# EAGLE design brama (EAGLE 6.3)
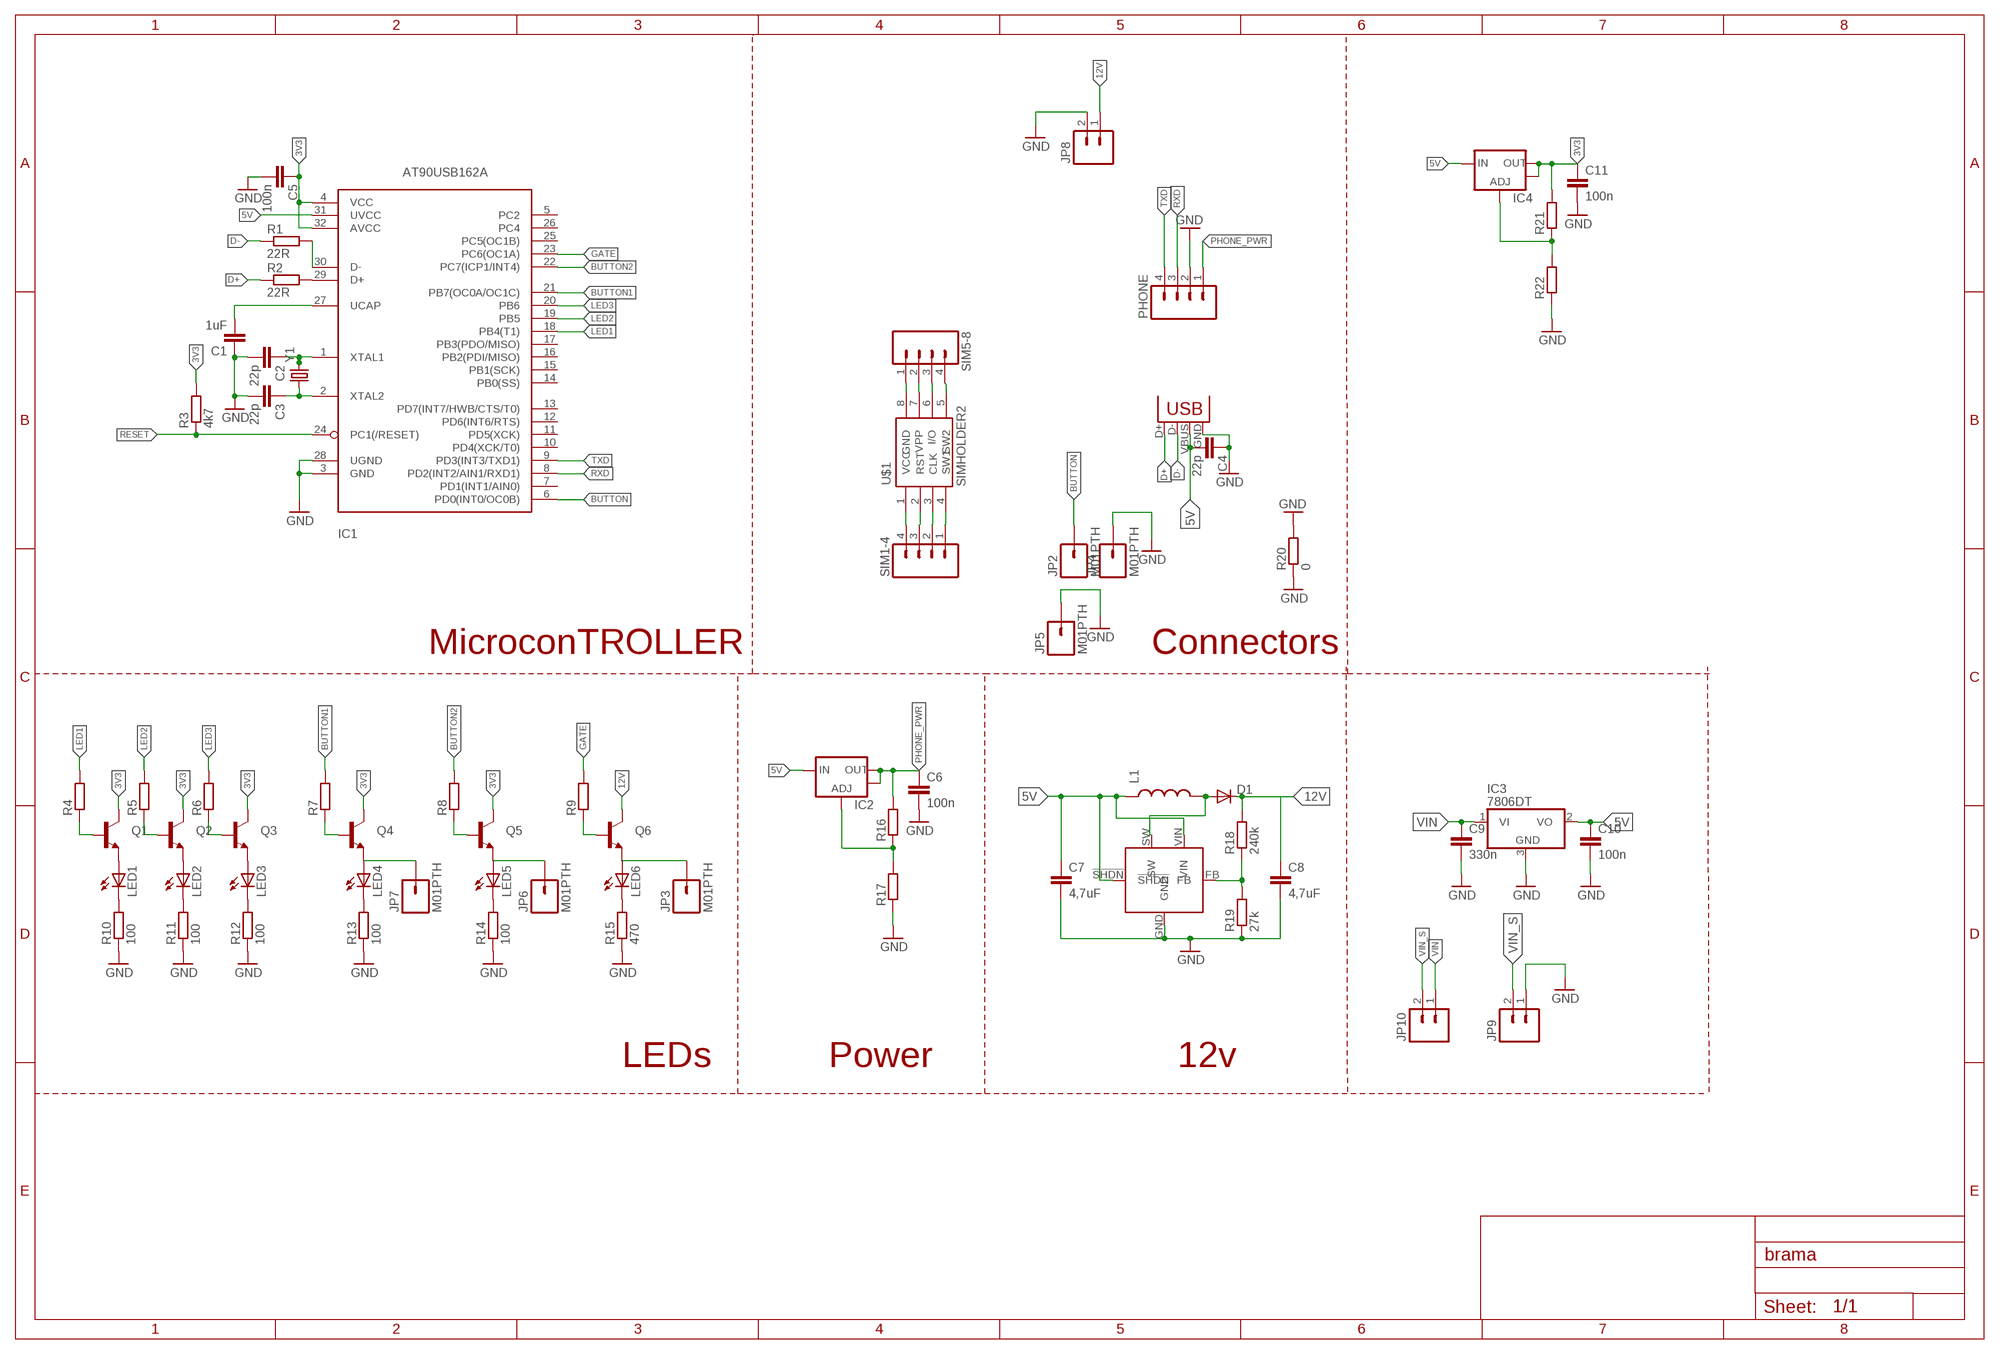
[diagram p0: schematic, sheet 1]

## Parts
C1  1uF  C-EUC0805  [C0805]
C2  22p  C-EUC0805  [C0805]
C3  22p  C-EUC0805  [C0805]
C4  22p  C-EUC0805  [C0805]
C5  100n  C-EUC0805  [C0805]
C6  100n  C-EUC0805  [C0805]
C7  4,7uF  C-EUC0805  [C0805]
C8  4,7uF  C-EUC0805  [C0805]
C9  330n  C-EUC0805  [C0805]
C10  100n  C-EUC0805  [C0805]
C11  100n  C-EUC0805  [C0805]
D1  DIODESMB  [SMB-DIODE]
IC1  AT90USB162A  [TQFP32-08]
IC2  V_REG_LM1117SOT223  [SOT223]
IC3  7806DT  [TO252]
IC4  V_REG_LM1117SOT223  [SOT223]
JP1  USBSMD  [USB-MINIB]
JP2  M01PTH  [1X01]
JP3  M01PTH  [1X01]
JP4  M01PTH  [1X01]
JP5  M01PTH  [1X01]
JP6  M01PTH  [1X01]
JP7  M01PTH  [1X01]
JP8  M02PTH3  [1X02_LONGPADS]
JP9  M02PTH3  [1X02_LONGPADS]
JP10  M02PTH3  [1X02_LONGPADS]
L1  INDUCTOR0805  [0805]
LED1  LEDCHIPLED_0805  [CHIPLED_0805]
LED2  LEDCHIPLED_0805  [CHIPLED_0805]
LED3  LEDCHIPLED_0805  [CHIPLED_0805]
LED4  LEDCHIPLED_0805  [CHIPLED_0805]
LED5  LEDCHIPLED_0805  [CHIPLED_0805]
LED6  LEDCHIPLED_0805  [CHIPLED_0805]
PHONE  M04LONGPADS  [1X04_LONGPADS]
Q1  TRANSISTOR_NPNSOT23  [SOT23]
Q2  TRANSISTOR_NPNSOT23  [SOT23]
Q3  TRANSISTOR_NPNSOT23  [SOT23]
Q4  TRANSISTOR_NPNSOT23  [SOT23]
Q5  TRANSISTOR_NPNSOT23  [SOT23]
Q6  TRANSISTOR_NPNSOT23  [SOT23]
R1  22R  R-EU_R0805  [R0805]
R2  22R  R-EU_R0805  [R0805]
R3  4k7  R-EU_R0805  [R0805]
R4  R-EU_R0805  [R0805]
R5  R-EU_R0805  [R0805]
R6  R-EU_R0805  [R0805]
R7  R-EU_R0805  [R0805]
R8  R-EU_R0805  [R0805]
R9  R-EU_R0805  [R0805]
R10  100  R-EU_R0805  [R0805]
R11  100  R-EU_R0805  [R0805]
R12  100  R-EU_R0805  [R0805]
R13  100  R-EU_R0805  [R0805]
R14  100  R-EU_R0805  [R0805]
R15  470  R-EU_R0805  [R0805]
R16  R-EU_R0805  [R0805]
R17  R-EU_R0805  [R0805]
R18  240k  R-EU_R0805  [R0805]
R19  27k  R-EU_R0805  [R0805]
R20  0  R-EU_R0805  [R0805]
R21  R-EU_R0805  [R0805]
R22  R-EU_R0805  [R0805]
SIM1-4  M04LONGPADS  [1X04_LONGPADS]
SIM5-8  M04LONGPADS  [1X04_LONGPADS]
U$1  SIMHOLDER2  [SIMHOLDER2]
U$6  LM2704MF-ADJ  [SOT23-5]
Y1  CRYSTALSMD  [HC49UP]

## Nets
3V3: C5.1 C11.1 IC1.4(VCC) IC1.32(AVCC) IC4.2(OUT) IC4.4(OUT) Q1.3(C) Q2.3(C) Q3.3(C) Q4.3(C) Q5.3(C) R3.2 R21.2
5V: C4.2 C7.1 C10.1 IC1.31(UVCC) IC2.3(IN) IC3.2(VO) IC4.3(IN) JP1.VBUS L1.1 U$6.!SHDN U$6.VIN
12V: C8.1 D1.C JP8.1 Q6.3(C) R18.2
BUTTON: IC1.6(PD0(INT0/OC0B)) JP2.1
BUTTON1: IC1.21(PB7(OC0A/OC1C)) R7.2
BUTTON2: IC1.22(PC7(ICP1/INT4)) R8.2
D+: JP1.D+ R2.1
D-: JP1.D- R1.1
GATE: IC1.23(PC6(OC1A)) R9.2
GND: C1.1 C2.2 C3.2 C4.1 C5.2 C6.2 C7.2 C8.2 C9.2 C10.2 C11.2 IC1.3(GND) IC1.28(UGND) IC3.3(GND) JP1.GND JP4.1 JP5.1 JP8.2 JP9.1 PHONE.2 R10.1 R11.1 R12.1 R13.1 R14.1 R15.1 R17.1 R19.1 R20.1 R20.2 R22.1 U$6.GND
LED1: IC1.18(PB4(T1)) R4.2
LED2: IC1.19(PB5) R5.2
LED3: IC1.20(PB6) R6.2
N$1: IC1.30(D-) R1.2
N$2: IC1.29(D+) R2.2
N$3: C2.1 IC1.1(XTAL1) Y1.2
N$4: C3.1 IC1.2(XTAL2) Y1.1
N$5: SIM1-4.4 U$1.1(VCC)
N$6: LED1.A Q1.2(E)
N$7: LED2.A Q2.2(E)
N$8: LED3.A Q3.2(E)
N$9: JP7.1 LED4.A Q4.2(E)
N$10: JP6.1 LED5.A Q5.2(E)
N$11: JP3.1 LED6.A Q6.2(E)
N$12: Q1.1(B) R4.1
N$13: Q2.1(B) R5.1
N$14: Q3.1(B) R6.1
N$15: Q4.1(B) R7.1
N$16: Q5.1(B) R8.1
N$17: Q6.1(B) R9.1
N$18: LED1.C R10.2
N$19: LED2.C R11.2
N$20: LED3.C R12.2
N$21: LED4.C R13.2
N$22: LED5.C R14.2
N$23: LED6.C R15.2
N$24: SIM5-8.1 U$1.8(GND)
N$25: SIM5-8.2 U$1.7(VPP)
N$26: SIM5-8.3 U$1.6(I/O)
N$27: SIM5-8.4 U$1.5(SW2)
N$28: SIM1-4.1 U$1.4(SW1)
N$29: SIM1-4.2 U$1.3(CLK)
N$30: SIM1-4.3 U$1.2(RST)
N$31: D1.A L1.2 U$6.SW
N$32: IC2.1(ADJ) R16.1 R17.2
N$33: IC4.1(ADJ) R21.1 R22.2
N$34: R18.1 R19.2 U$6.FB
PHONE_PWR: C6.1 IC2.2(OUT) IC2.4(OUT) PHONE.1 R16.2
RESET: IC1.24(PC1(/RESET)) R3.1
RXD: IC1.8(PD2(INT2/AIN1/RXD1)) PHONE.3
TXD: IC1.9(PD3(INT3/TXD1)) PHONE.4
UCAP: C1.2 IC1.27(UCAP)
VIN: C9.1 IC3.1(VI) JP10.1
VIN_S: JP9.2 JP10.2
Unconnected: IC1.5(PC2) IC1.7(PD1(INT1/AIN0)) IC1.10(PD4(XCK/T0)) IC1.11(PD5(XCK)) IC1.12(PD6(INT6/RTS)) IC1.13(PD7(INT7/HWB/CTS/T0)) IC1.14(PB0(SS)) IC1.15(PB1(SCK)) IC1.16(PB2(PDI/MISO)) IC1.17(PB3(PDO/MISO)) IC1.25(PC5(OC1B)) IC1.26(PC4)

## Notes on the sheet
- MicroconTROLLER | Connectors
- LEDs | Power | 12v

## Library data of the parts
C1-C11 = rcl:C-EU: CAPACITOR, European symbol
D1 = SparkFun-DiscreteSemi:DIODE: Diode These are standard reverse protection diodes and small signal diodes. SMA package can handle up to about 1A. SOD-323 can handle about 200mA. What the SOD-323 package when ordering, there are some mfgs out there that are 5-pin packages.
IC1 = adafruit:AT90USB162: MICROCONTROLLER 8 Kbytes FLASH 1 kbytes SRAM 512 bytes EEPROM USART 6-channel 10 bit ADC 2-channel 8 bit ADC
IC2 IC4 = SparkFun-PowerIC:V_REG_LM1117: Voltage Regulator LM1117 Standard adjustable voltage regulator but in SMD form. Spark Fun Electronics SKU : COM-00595
IC3 = linear:78*: Positive VOLTAGE REGULATOR Source: http://cache.national.com/ds/LM/LM78L05.pdf http://www.fairchildsemi.com/ds/LM/LM7805.pdf
JP1 = SparkFun-Connectors:USB: USB Connectors USB-B-PTH is fully proven SKU : PRT-00139/CONN-08278 USB-miniB is fully proven SKU : PRT-00587 USB-A-PCB is untested. USB-A-H is throughly reviewed, but untested. Spark Fun Electronics SKU : PRT-00437 USB-B-SMT is throughly reviewed, but untested. Needs silkscreen touching up. USB-A-S has not been used/tested USB-MB-H has not been used/tested USB-MICROB has been used. CONN-09505
JP2-JP7 = SparkFun-Connectors:M01: Header 1 Standard 1-pin 0.1" header. Use with straight break away headers (SKU : PRT-00116), right angle break away headers (PRT-00553), swiss pins (PRT-00743), machine pins (PRT-00117), and female headers (PRT-00115).
JP8-JP10 = SparkFun-Connectors:M02: Header 2 Standard 2-pin 0.1" header. Use with straight break away headers (SKU : PRT-00116), right angle break away headers (PRT-00553), swiss pins (PRT-00743), machine pins (PRT-00117), and female headers (PRT-00115). Molex polarized connector foot print use with SKU : PRT-08233 with associated crimp pins and housings.
L1 = SparkFun-Passives:INDUCTOR: Inductors Basic Inductor/Choke - 0603 and 1206. Footprints are not proven and vary greatly between part numbers.
LED1-LED6 = led:LED: LED OSRAM: - CHIPLED LG R971, LG N971, LY N971, LG Q971, LY Q971, LO R971, LY R971 LH N974, LH R974 LS Q976, LO Q976, LY Q976 LO Q996 - Hyper CHIPLED LW Q18S LB Q993, LB Q99A, LB R99A - SideLED LS A670, LO A670, LY A670, LG A670, LP A670 LB A673, LV A673, LT A673, LW A673 LH A674 LY A675 LS A676, LA A676, LO A676, LY A676, LW A676 LS A679, LY A679, LG A679 - Hyper Micro SIDELED® LS Y876, LA Y876, LO Y876, LY Y876 LT Y87S - SmartLED LW L88C, LW L88S LB L89C, LB L89S, LG L890 LS L89K, LO L89K, LY L89K LS L896, LA L896, LO L896, LY L896 - TOPLED LS T670, LO T670, LY T670, LG T670, LP T670 LSG T670, LSP T670, LSY T670, LOP T670, LYG T670 LG T671, LOG T671, LSG T671 LB T673, LV T673, LT T673, LW T673 LH T674 LS T676, LA T676, LO T676, LY T676, LB T676, LH T676, LSB T676, LW T676 LB T67C, LV T67C, LT T67C, LS T67K, LO T67K, LY T67K, LW E67C LS E67B, LA E67B, LO E67B, LY E67B, LB E67C, LV E67C, LT E67C LW T67C LS T679, LY T679, LG T679 LS T770, LO T770, LY T770, LG T770, LP T770 LB T773, LV T773, LT T773, LW T773 LH T774 LS E675, LA E675, LY E675, LS T675 LS T776, LA T776, LO T776, LY T776, LB T776 LHGB T686 LT T68C, LB T68C - Hyper Mini TOPLED® LB M676 - Mini TOPLED Santana® LG M470 LS M47K, LO M47K, LY M47K Source: http://www.osram.convergy.de LUXEON: - LUMILED® LXK2-PW12-R00, LXK2-PW12-S00, LXK2-PW14-U00, LXK2-PW14-V00 LXK2-PM12-R00, LXK2-PM12-S00, LXK2-PM14-U00 LXK2-PE12-Q00, LXK2-PE12-R00, LXK2-PE12-S00, LXK2-PE14-T00, LXK2-PE14-U00 LXK2-PB12-K00, LXK2-PB12-L00, LXK2-PB12-M00, LXK2-PB14-N00, LXK2-PB14-P00, LXK2-PB14-Q00 LXK2-PR12-L00, LXK2-PR12-M00, LXK2-PR14-Q00, LXK2-PR14-R00 LXK2-PD12-Q00, LXK2-PD12-R00, LXK2-PD12-S00 LXK2-PH12-R00, LXK2-PH12-S00 LXK2-PL12-P00, LXK2-PL12-Q00, LXK2-PL12-R00 Source: www.luxeon.com KINGBRIGHT: KA-3528ASYC Source: www.kingbright.com
PHONE SIM1-4 SIM5-8 = SparkFun-Connectors:M04: Header 4 Standard 4-pin 0.1" header. Use with straight break away headers (SKU : PRT-00116), right angle break away headers (PRT-00553), swiss pins (PRT-00743), machine pins (PRT-00117), and female headers (PRT-00115). Molex polarized connector foot print use with SKU : PRT-08231 with associated crimp pins and housings. 1MM SMD Version SKU: PRT-10208
Q1-Q6 = SparkFun-DiscreteSemi:TRANSISTOR_NPN: Generic NPN BJT. MMBT2222 is the common NPN we use. Double check against datasheet- not all devices are the same!
R1-R22 = rcl:R-EU_: RESISTOR, European symbol
U$1 = SparkFun-Connectors:SIMHOLDER2: Alternate SIM card socket.
U$6 = Step-Up:LM2704MF-ADJ: LM2704 Micropower Step-up DC/DC Converter with 550mA Peak Current Limit http://www.ti.com.cn/general/cn/docs/lit/getliterature.tsp?genericPartNumber=lm2704&fileType=pdf
Y1 = SparkFun-FreqCtrl:CRYSTAL: Various standard crystals. Proven footprints. Spark Fun Electronics SKU : COM-00534

## Board
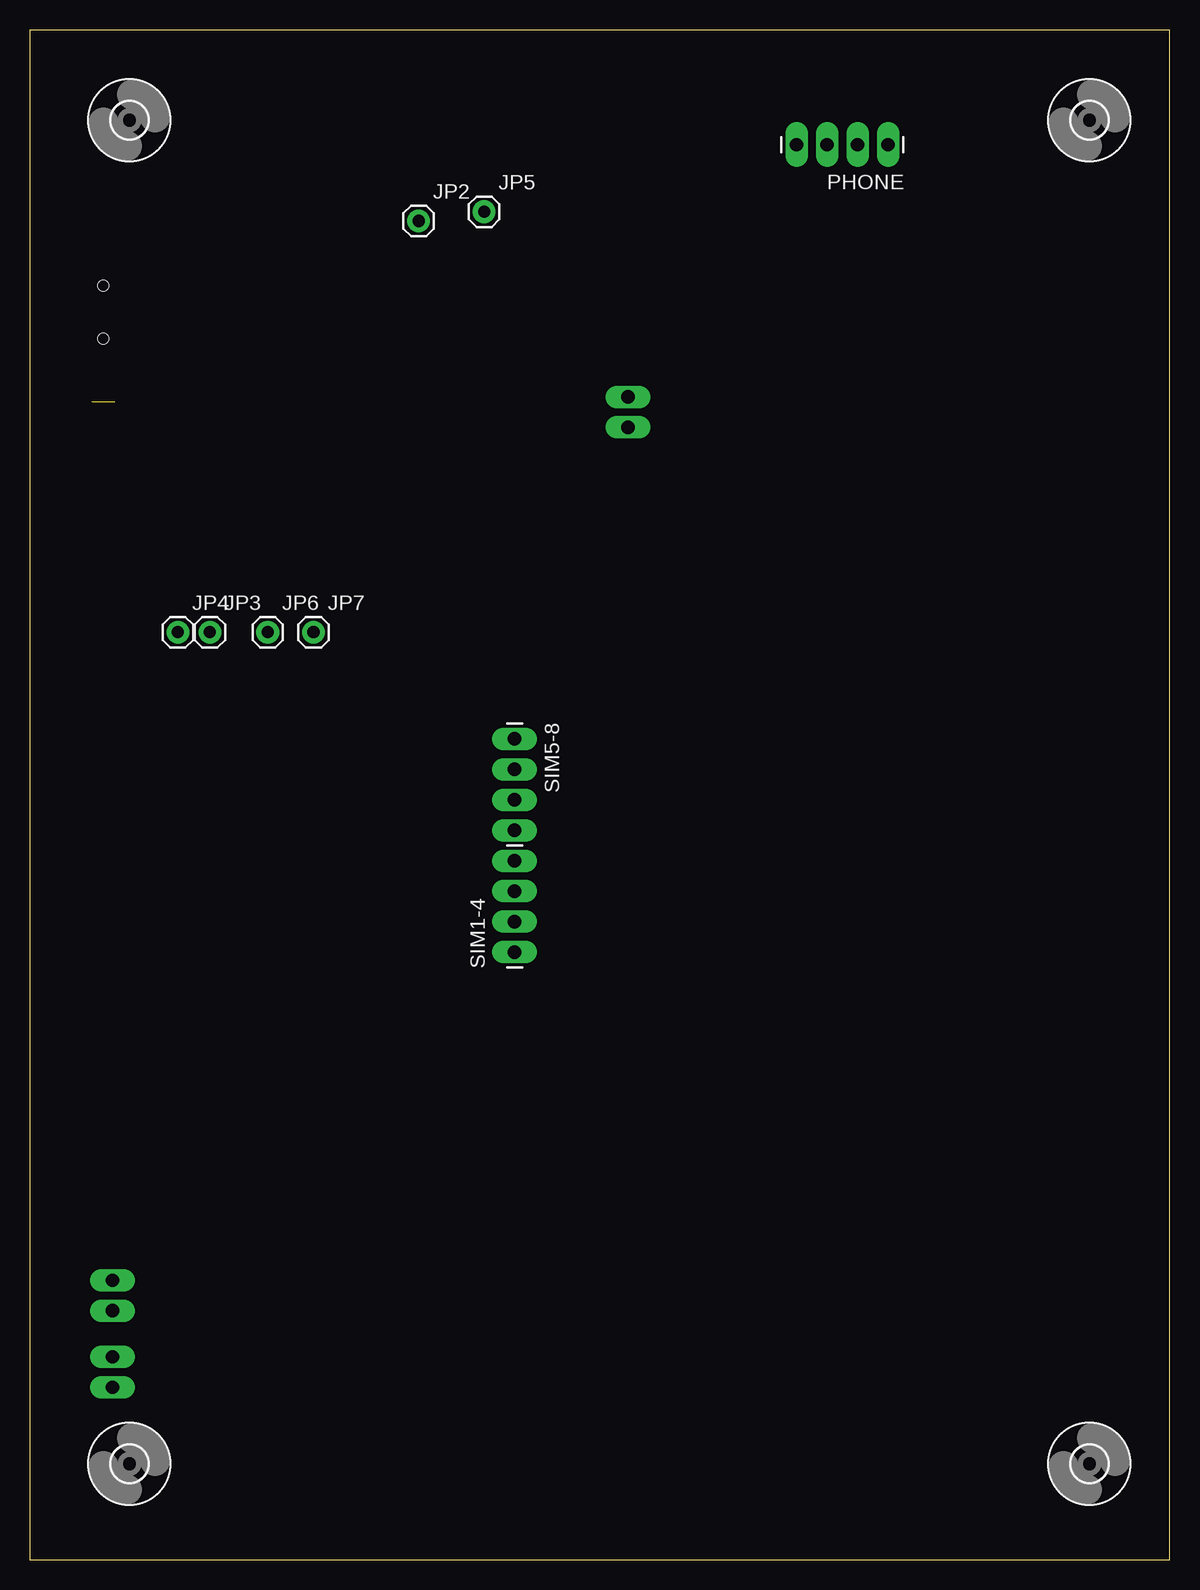
[diagram p1: board, top side]
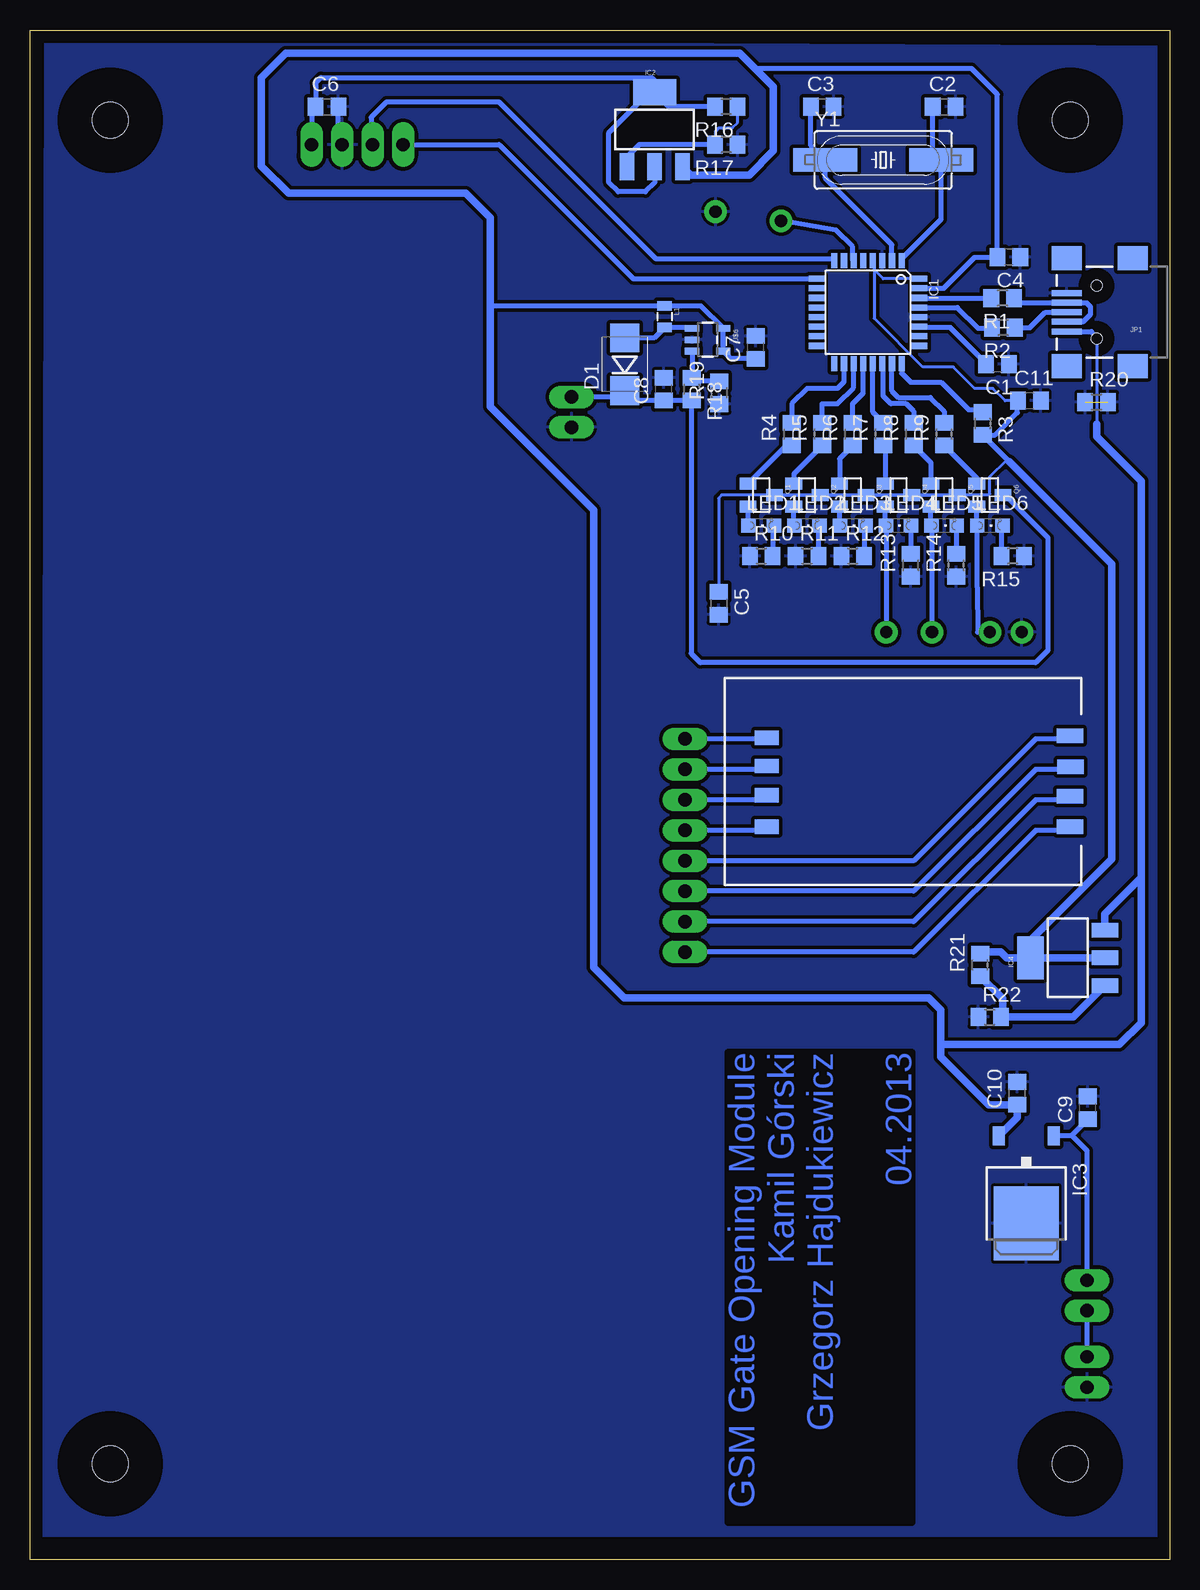
[diagram p2: board, bottom side, seen from below]

Size 94.98 x 127.51 mm. Coordinates in mm from the lower left corner, seen from the top.
Outline: 0,0 94.98,0 94.98,127.51 0,127.51 0,0
Copper layers (1*16): Top 0.035mm / dielectric 1.5mm / Bottom 0.035mm
Design rules "default": minimum track width 10mil, minimum drill 24mil, track to track 8mil, track to pad 8mil, pad to pad 8mil, via to via 8mil, smd to smd 8mil, copper to edge 40mil, drill to drill 8mil, minimum pad ring 10mil, minimum via ring 8mil, stop-mask expansion 4mil, vias tented up to drill 0mil, thermal gap 10mil

### Footprints (pad centres in the part's own frame; a part is rotated, then mirrored left to right if it is on the bottom)
C0805 = smd 1.3 x 1.5: 1 -0.95,0; 2 0.95,0
SMB-DIODE = smd 2.4 x 2.4: A 2.2,0; C -2.2,0
TQFP32-08 = smd 1.27 x 0.508: 1 -4.293,2.8; 2 -4.293,2; 3 -4.293,1.2; 4 -4.293,0.4; 5 -4.293,-0.4; 6 -4.293,-1.2; 7 -4.293,-2; 8 -4.293,-2.8; 17 4.293,-2.8; 18 4.293,-2; 19 4.293,-1.2; 20 4.293,-0.4; 21 4.293,0.4; 22 4.293,1.2; 23 4.293,2; 24 4.293,2.8 | smd 0.508 x 1.27: 9 -2.8,-4.293; 10 -2,-4.293; 11 -1.2,-4.293; 12 -0.4,-4.293; 13 0.4,-4.293; 14 1.2,-4.293; 15 2,-4.293; 16 2.8,-4.293; 25 2.8,4.293; 26 2,4.293; 27 1.2,4.293; 28 0.4,4.293; 29 -0.4,4.293; 30 -1.2,4.293; 31 -2,4.293; 32 -2.8,4.293
SOT223 = smd 1.219 x 2.235: 1 -2.311,-3.099; 2 0,-3.099; 3 2.311,-3.099 | smd 3.6 x 2.2: 4 0,3.099
TO252 = smd 1 x 1.6: 1 -2.28,-4.8; 2 2.28,-4.8 | smd 5.4 x 6.2: 3 0,2.5
USB-MINIB = smd 2.5 x 0.5: D+ 2.5,0; D- 2.5,0.8; GND 2.5,-1.6; ID 2.5,-0.8; VBUS 2.5,1.6 | smd 2.5 x 2: MTN1 -3,4.5; MTN2 2.5,4.5; MTN3 -3,-4.5; MTN4 2.5,-4.5 | hole 0.9: 0,2.2; 0,-2.2
1X01 = drill 1.016 pad 1.88: 1 0,0
1X02_LONGPADS = drill 1.118 pad 1.88 long: 1 0,0; 2 2.54,0
0805 = smd 0.8 x 1.2: 1 -0.9,0; 2 0.9,0
CHIPLED_0805 = smd 1.2 x 1.2: A 0,-1.05; C 0,1.05
1X04_LONGPADS = drill 1.118 pad 1.88 long: 1 0,0; 2 2.54,0; 3 5.08,0; 4 7.62,0
SOT23 = smd 1 x 1.4: 1 -0.95,-1.1; 2 0.95,-1.1; 3 0,1.1
R0805 = smd 1.3 x 1.5: 1 -0.95,0; 2 0.95,0
SIMHOLDER2 = smd 2.2 x 1.2: 1 0.95,4.81; 2 0.91,7.41; 3 0.95,9.86; 4 0.95,12.39 | smd 2 x 1.2: 5 26.22,12.42; 6 26.2,9.78; 7 26.22,7.34; 8 26.22,4.98
3,0 = hole 3: 0,0
SOT23-5 = smd 0.55 x 1.2: !SHDN 0.95,1.3; FB 0.95,-1.3; GND 0,-1.3; SW -0.95,-1.3; VIN -0.95,1.3
HC49UP = smd 5.334 x 1.93: 1 -4.826,0; 2 4.826,0

### Placement (x,y rotation side)
C1  14.35,99.67 180 bottom
C2  18.8,121.12 0 bottom
C3  28.96,121.12 0 bottom
C4  13.41,108.58 180 bottom
C5  37.59,79.72 270 bottom
C6  70.23,121.12 0 bottom
C7  34.5,101.05 90 bottom
C8  42.15,97.58 90 bottom
C9  6.82,37.66 90 bottom
C10  12.71,38.87 90 bottom
C11  11.68,96.61 0 bottom
D1  45.4,99.64 90 bottom
IC1  25.15,103.98 270 bottom
IC2  42.93,119.22 0 bottom
IC3  11.96,30.53 180 bottom
IC4  8.49,50.17 90 bottom
JP1  6.1,103.98 180 bottom
JP2  32.38,111.6 0 top
JP3  14.99,77.31 0 top
JP4  12.32,77.31 0 top
JP5  37.85,112.36 0 top
JP6  19.81,77.31 0 top
JP7  23.62,77.31 0 top
JP8  49.84,96.93 270 top
JP9  6.88,14.36 90 top
JP10  6.88,23.28 270 top
L1  42.09,103.61 270 bottom
LED1  34.04,86.2 270 bottom
LED2  30.23,86.2 270 bottom
LED3  26.42,86.2 270 bottom
LED4  22.61,86.2 270 bottom
LED5  18.8,86.2 270 bottom
LED6  14.99,86.2 270 bottom
PHONE  71.5,117.95 180 top
Q1  34.04,88.74 270 bottom
Q2  30.23,88.74 270 bottom
Q3  26.42,88.74 270 bottom
Q4  22.61,88.74 270 bottom
Q5  18.8,88.74 270 bottom
Q6  14.99,88.74 270 bottom
R1  13.92,105.16 180 bottom
R2  13.87,102.7 180 bottom
R3  15.59,94.71 270 bottom
R4  31.5,93.82 90 bottom
R5  28.96,93.82 90 bottom
R6  26.42,93.82 90 bottom
R7  23.88,93.82 90 bottom
R8  21.34,93.82 90 bottom
R9  18.8,93.82 90 bottom
R10  34.04,83.66 0 bottom
R11  30.23,83.66 0 bottom
R12  26.42,83.66 0 bottom
R13  21.59,82.9 90 bottom
R14  17.78,82.9 90 bottom
R15  13.08,83.66 180 bottom
R16  36.96,121.12 180 bottom
R17  36.96,117.95 180 bottom
R18  39.84,97.58 270 bottom
R19  37.52,97.28 90 bottom
R20  6.1,96.5 0 bottom
R21  15.81,49.57 90 bottom
R22  15,45.23 0 bottom
SIM1-4  40.39,50.64 90 top
SIM5-8  40.39,68.42 270 top
U$1  7.37,73.5 180 bottom
U$2  [3,0]  88.29,8 0 top
U$3  [3,0]  8.29,120 0 top
U$4  [3,0]  88.29,120 0 top
U$5  [3,0]  8.29,8 0 top
U$6  38.5,101.69 270 bottom
Y1  23.88,116.68 0 bottom

### Tracks (layer width: path | path; a pad name or v marks a point on that pad's centre or on a via)
3V3
  Bottom 0.254: Q5.3 15.09,88.74 14.99,88.84 14.99,90.26 13.54,91.71 | Q1.3 37.34,88.74 37.59,88.49 C5.1 | C11.1 13.72,96.61 14.73,97.63 16.26,97.63 18.03,99.41 20.57,99.41 24.64,103.47 24.64,107.54 | 24.64,107.54 24.64,108.17 IC1.4 | IC1.32 23.88,106.78 24.64,107.54
  Bottom 0.305: Q5.3 Q4.3 Q3.3 Q2.3 Q1.3
  Bottom 0.406: 13.37,91.53 13.54,91.71 R3.2 14.54,93.76 12.7,95.6 12.7,96.55 C11.1
  Bottom 0.61: IC4.4 11.59,51.65 4.83,58.42 4.83,82.99 13.37,91.53 | IC4.4 IC4.2 | IC4.4 13.59,50.17 14.09,50.67 15.66,50.67 R21.2
5V
  Bottom 0.254: 6.1,101.95 6.1,94.66
  Bottom 0.305: 56.41,104.51 56.64,104.74
  Bottom 0.406: L1.1 39.07,104.51 U$6.VIN U$6.!SHDN 36.56,100.1 C7.1 | L1.1 48.24,104.51 | JP1.VBUS 6.53,102.38 6.1,101.95 | L1.1 56.41,104.51 | IC1.31 18.83,105.98 16.26,108.55 14.38,108.55 | 14.38,108.55 C4.2 14.36,122.15 16.51,124.3 34.29,124.3 34.42,124.17 | 14.38,108.55 14.38,108.2
  Bottom 0.61: IC3.2 12.71,36.86 C10.1 15.07,37.92 19.07,41.92 19.07,42.71 | IC2.3 39.9,115.41 35.05,115.41 33.02,117.44 33.02,122.78 34.42,124.17 35.81,125.57 73.66,125.57 75.69,123.54 75.69,116.17 73.41,113.89 58.67,113.89 56.64,111.85 56.64,104.74 56.64,96.11 48.01,87.47 48.01,49.37 45.47,46.83 20.07,46.83 19.07,45.83 19.07,42.71 | IC4.3 5.4,53.83 2.37,56.85 2.37,56.87 | 2.37,56.87 2.37,89.89 6.08,93.6 6.08,94.64 6.1,94.66 | 18.89,42.93 4.2,42.93 2.39,44.75 2.39,56.88 2.37,56.87 | 18.89,42.93 19,43.04 | 18.89,42.93 18.89,42.89 19.07,42.71
12V
  Bottom 0.406: R18.2 | R18.2 C8.1 44.59,96.63 D1.C 45.91,96.93 JP8.1 | Q6.3 13.72,88.74 10.16,85.18 10.16,75.79 11.18,74.77 39.12,74.77 39.88,75.53 39.88,96.59 R18.2
BUTTON
  Bottom 0.406: IC1.6 26.42,108.34 26.42,109.44 27.81,110.84 JP2.1
BUTTON1
  Bottom 0.406: IC1.21 24.75,95.64 R7.2
BUTTON2
  Bottom 0.406: IC1.22 23.88,99.62 23.88,97 23.24,96.36 21.97,96.36 21.34,95.73 R8.2
D+
  Bottom 0.406: R2.1 11.65,102.7 10.37,103.98 JP1.D+ 8.65,103.92
D-
  Bottom 0.406: JP1.D- 7.21,103.18 6.58,103.81 6.58,104.42 6.9,104.74 12.55,104.74 R1.1
GATE
  Bottom 0.406: IC1.23 23.15,97.41 22.61,96.87 19.94,96.87 18.8,95.73 R9.2
GND  (1 unrouted)
  Bottom 0.406: PHONE.2 69.28,118.27 C6.2
  pour Bottom (isolate 0.305): -1.78,126.06 93.73,126.57 93.98,2.02 -1.27,2.02
LED1
  Bottom 0.406: IC1.18 27.15,98.17 27.69,97.63 30.23,97.63 31.5,96.36 R4.2
LED2
  Bottom 0.406: R5.2 28.96,96.36 27.69,96.36 26.35,97.7 IC1.19
LED3
  Bottom 0.406: R6.2 26.42,96.36 25.55,97.23 IC1.20
N$1
  Bottom 0.254: 20.78,105.25 20.67,105.14
  Bottom 0.406: IC1.30 20.78,105.25 | 20.67,105.14 14.89,105.14 R1.2
N$2
  Bottom 0.406: IC1.29 17.7,104.38 15.97,102.65 14.87,102.65 R2.2
N$3
  Bottom 0.406: C2.1 19.75,117.38 Y1.2 19.05,111.73 22.35,108.43 IC1.1
N$4
  Bottom 0.406: C3.1 29.91,117.88 Y1.1 28.7,115.16 23.15,109.6 IC1.2
N$5
  Bottom 0.406: U$1.1 8.59,68.42 11.18,68.42 21.34,58.26 SIM1-4.4
N$6
  Bottom 0.406: LED1.A 35.14,86.25 Q1.2
N$7
  Bottom 0.406: LED2.A 31.33,86.25 Q2.2
N$8
  Bottom 0.406: LED3.A 27.52,86.25 Q3.2
N$9
  Bottom 0.406: Q4.2 23.71,86.25 LED4.A 23.62,86.17 JP7.1
N$10
  Bottom 0.406: Q5.2 19.9,86.25 LED5.A 19.81,86.17 JP6.1
N$11
  Bottom 0.406: Q6.2 16.09,86.25 LED6.A 16.04,81.03 16,77.31 JP3.1
N$12
  Bottom 0.406: Q1.1 31.96,92.87 R4.1
N$13
  Bottom 0.406: R5.1 31.33,90.5 Q2.1
N$14
  Bottom 0.406: R6.1 27.52,91.77 Q3.1
N$15
  Bottom 0.406: R7.1 23.71,92.7 Q4.1
N$16
  Bottom 0.406: R8.1 19.9,91.43 Q5.1
N$17
  Bottom 0.406: R9.1 16.09,90.16 Q6.1
N$18
  Bottom 0.406: LED1.C 33.09,86.1 R10.2
N$19
  Bottom 0.406: LED2.C 29.28,86.1 R11.2
N$20
  Bottom 0.406: LED3.C 25.47,86.1 R12.2
N$21
  Bottom 0.406: 21.66,86.1 LED4.C 21.56,83.88 R13.2
N$22
  Bottom 0.406: 17.85,86.1 LED5.C 17.75,83.88 R14.2
N$23
  Bottom 0.406: LED6.C 14.04,86.1 R15.2
N$24
  Bottom 0.406: U$1.8 33.69,68.42 SIM5-8.1
N$25
  Bottom 0.406: U$1.7 33.87,65.88 SIM5-8.2
N$26
  Bottom 0.406: U$1.6 33.95,63.34 SIM5-8.3
N$27
  Bottom 0.406: U$1.5 33.87,60.8 SIM5-8.4
N$28
  Bottom 0.406: U$1.4 8.63,60.8 11.18,60.8 21.34,50.64 SIM1-4.1
N$29
  Bottom 0.406: U$1.3 8.62,63.34 11.18,63.34 21.34,53.18 SIM1-4.2
N$30
  Bottom 0.406: U$1.2 8.49,65.88 11.18,65.88 21.34,55.72 SIM1-4.3
N$31
  Bottom 0.406: U$6.SW 39.8,102.71 L1.2 42.96,101.84 D1.A
N$32
  Bottom 0.254: R17.2 37.85,118.01 37.85,119.09 37.59,119.35 36.45,119.35 36.01,119.79 R16.1
  Bottom 0.406: R17.2 44.2,117.95 45.24,116.91 IC2.1
N$33
  Bottom 0.61: R21.1 15.77,48.62 13.92,46.77 13.92,45.36 R22.2 8.03,45.23 IC4.1
N$34
  Bottom 0.406: R18.1 | U$6.FB 39.8,98.53 R18.1 | R19.2 39.54,98.23 R18.1
PHONE_PWR
  Bottom 0.406: R16.2 41.73,121.12 IC2.4 | IC2.2 42.93,114.78 43.69,114.01 45.97,114.01 46.74,114.78 46.74,118.97 44.26,121.44 | 44.26,121.44 43.38,122.32 IC2.4 | 44.51,121.44 44.26,121.44 | IC2.4 42.93,123.28 43.18,123.54 70.74,123.54 71.18,123.1 C6.1 71.5,120.81 PHONE.1
RESET
  Bottom 0.406: IC1.24 22.35,98.89 21.59,98.14 19.05,98.14 16.76,95.85 15.79,95.85 R3.1
RXD
  Bottom 0.406: IC1.8 28.1,108.42 42.8,108.42 55.88,121.51 65.28,121.51 66.55,120.24 66.55,118.08 PHONE.3
TXD
  Bottom 0.406: PHONE.4 55.88,117.95 44.7,106.77 IC1.9
UCAP
  Bottom 0.406: C1.2 15.75,100.17 18.29,102.71 20.78,102.71 IC1.27
VIN
  Bottom 0.406: 9.64,35.29 IC3.1 | IC3.1 9.82,35.33 | C9.1 8.16,35.37 | 8.16,35.37 8.2,35.33 IC3.1 | JP10.1 6.88,34.09 8.16,35.37
VIN_S
  Bottom 0.406: JP9.2 JP10.2

### Text on the board
Bottom: GSM Gate Opening Module / Kamil Górski / Grzegorz Hajdukiewicz / / 04.2013